# EAGLE design placaESP-AC_LAR_01 (EAGLE 8.0.0)
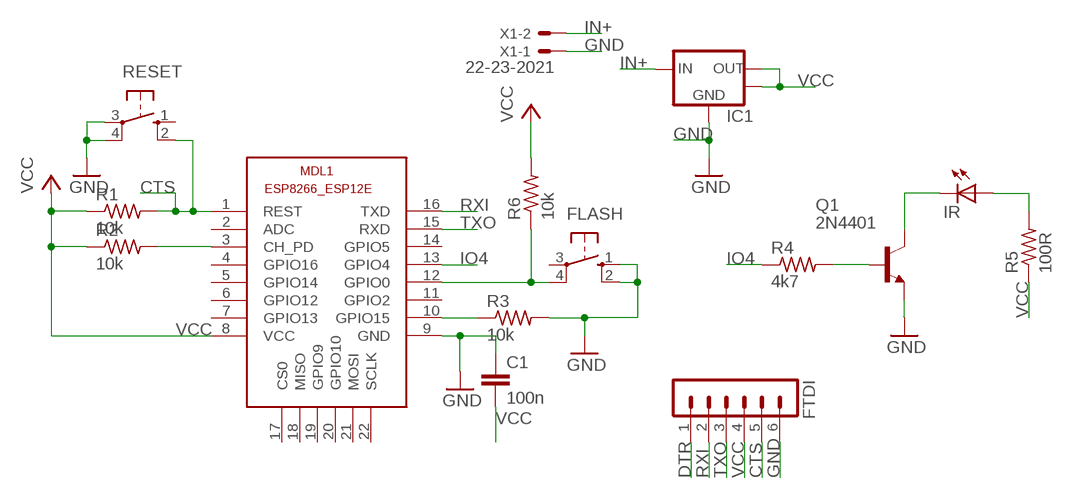
[diagram p0: schematic, sheet 1]

## Parts
C1  100n  C-EU025-025X050  [C025-025X050]
FLASH  10-XX  [B3F-10XX]
FTDI  MA06-1  [MA06-1]
IC1  AMS1117  [AMS1117]
IR  SFH482  [SFH482]
MDL1  ESP8266-12EESP8266-ESP12E  [ESP8266-ESP12E]
Q1  2N4401  2N4416  [TO92]
R1  10k  R-US_0207/10  [0207/10]
R2  10k  R-US_0207/10  [0207/10]
R3  10k  R-US_0207/10  [0207/10]
R4  4k7  R-US_0207/10  [0207/10]
R5  100R  R-US_0207/10  [0207/10]
R6  10k  R-US_0207/10  [0207/10]
RESET  10-XX  [B3F-10XX]
X1  22-23-2021  [22-23-2021]

## Nets
CTS: FTDI.5 MDL1.1(REST) R1.2 RESET.2(S1)
DTR: FTDI.1
GND: C1.1 FLASH.1(S) FLASH.2(S1) FTDI.6 IC1.GND(ADJ-GND) MDL1.9(GND) Q1.3(E) R3.2 RESET.3(P) RESET.4(P1) X1.1
IN+: IC1.VIN X1.2
IO4: MDL1.13(GPIO4) R4.1
N$1: MDL1.3(CH_PD) R2.2
N$2: IR.A R5.2
N$3: Q1.2(B) R4.2
N$4: IR.K(C) Q1.1(C)
N$5: MDL1.10(GPIO15) R3.1
N$6: FLASH.4(P1) MDL1.12(GPIO0) R6.1
RXI: FTDI.2 MDL1.16(TXD)
TXO: FTDI.3 MDL1.15(RXD)
VCC: C1.2 FTDI.4 IC1.HEATSINK IC1.VOUT MDL1.8(VCC) R1.1 R2.1 R5.1 R6.2
Unconnected: FLASH.3(P) MDL1.2(ADC) MDL1.4(GPIO16) MDL1.5(GPIO14) MDL1.6(GPIO12) MDL1.7(GPIO13) MDL1.11(GPIO2) MDL1.14(GPIO5) MDL1.17(CS0) MDL1.18(MISO) MDL1.19(GPIO9) MDL1.20(GPIO10) MDL1.21(MOSI) MDL1.22(SCLK) RESET.1(S)

## Library data of the parts
C1 = rcl:C-EU: CAPACITOR, European symbol
FLASH RESET = switch-omron:10-XX: OMRON SWITCH; MPN: B3F-1000; OC_FARNELL: 176432; OC_NEWARK: 36M3542
FTDI = con-lstb:MA06-1: PIN HEADER; OC_FARNELL: unknown; OC_NEWARK: unknown
IC1 = kaibader:AMS1117: Voltage Regulator AMS1117 Standard adjustable SMD voltage regulator.
IR = led:SFH482: IR LED infrared emitting diode, Infineon
MDL1 = ESP8266-ESP12E:ESP8266-12E: ESP8266-12E with additional I/O and GPIO04/05 corrected The author cannot warrant that this library is free from error or will meet your specific requirements. Created by PuceBaboon.com. Komagane, Nagano, JAPAN
Q1 = transistor-npn:2N4416: NPN Transistor
R1-R6 = rcl:R-US_: RESISTOR, American symbol
X1 = con-molex:22-23-2021: .100" (2.54mm) Center Header - 2 Pin; MF: MOLEX; MPN: 22-23-2021; OC_FARNELL: 1462926; OC_NEWARK: 25C3832

## Board
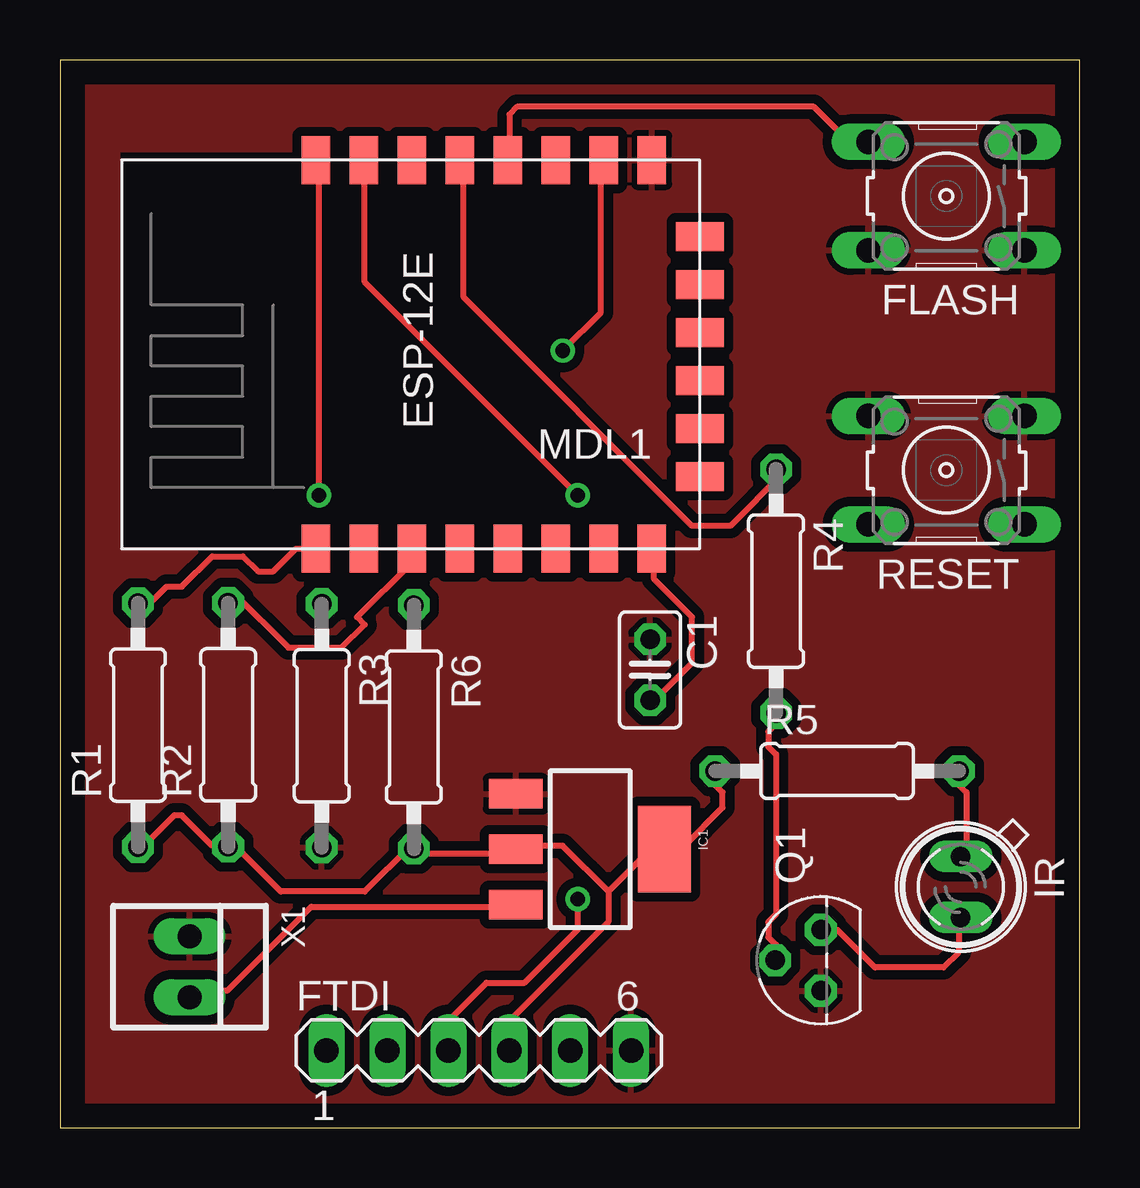
[diagram p1: board, top side]
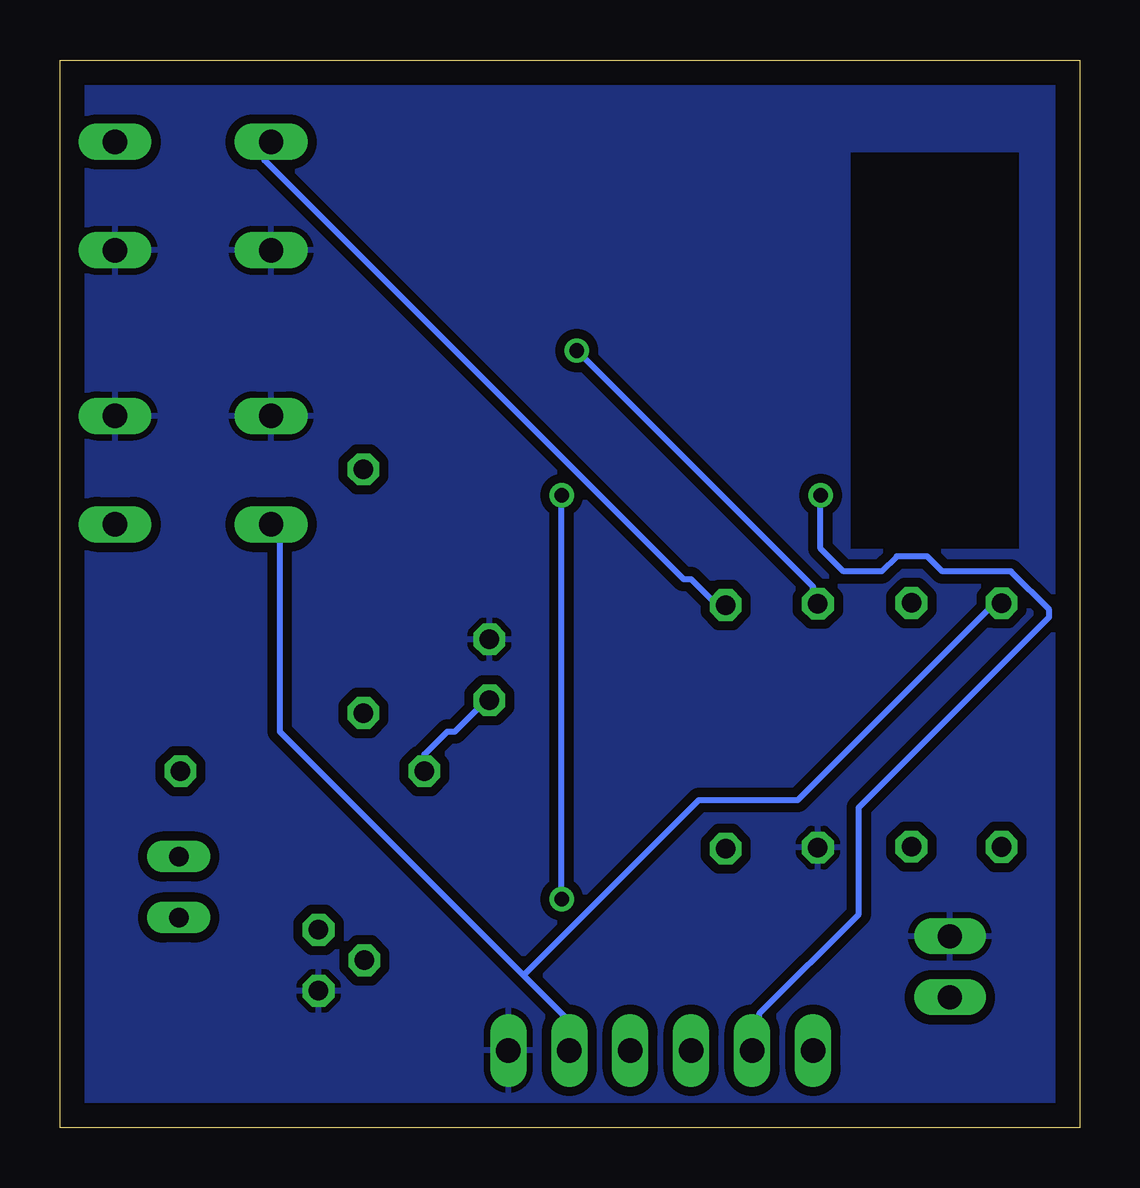
[diagram p2: board, bottom side, seen from below]

Size 42.5 x 44.5 mm. Coordinates in mm from the lower left corner, seen from the top.
Outline: 0,0 42.5,0 42.5,44.5 0,44.5 0,0
Copper layers (1*16): Top 0.035mm / dielectric 1.5mm / Bottom 0.035mm
Design rules "default *": minimum track width 10mil, minimum drill 24mil, track to track 15mil, track to pad 15mil, pad to pad 15mil, via to via 15mil, smd to smd 8mil, copper to edge 40mil, drill to drill 8mil, minimum pad ring 10mil, minimum via ring 8mil, stop-mask expansion 4mil, vias tented up to drill 0mil, thermal gap 10mil

### Footprints (pad centres in the part's own frame; a part is rotated, then mirrored left to right if it is on the bottom)
C025-025X050 = drill 0.813 octagon: 1 -1.27,0; 2 1.27,0
B3F-10XX = drill 1.016 long: 1 -3.251,2.261; 2 3.251,2.261; 3 -3.251,-2.261; 4 3.251,-2.261
MA06-1 = drill 1.016 long: 1 -6.35,0; 2 -3.81,0; 3 -1.27,0; 4 1.27,0; 5 3.81,0; 6 6.35,0
AMS1117 = smd 1.219 x 2.235: GND -2.311,-3.099; VIN 2.311,-3.099; VOUT 0,-3.099 | smd 3.6 x 2.2: HEATSINK 0,3.099
SFH482 = drill 0.813 long: A -1.27,0; K 1.27,0
ESP8266-ESP12E = smd 2 x 1.2: 1 -7.62,5.84; 2 -7.62,3.84; 3 -7.62,1.84; 4 -7.62,-0.16; 5 -7.62,-2.16; 6 -7.62,-4.16; 7 -7.62,-6.16; 8 -7.62,-8.16; 9 8.58,-8.16; 10 8.58,-6.16; 11 8.58,-4.16; 12 8.58,-2.16; 13 8.58,-0.16; 14 8.58,1.84; 15 8.58,3.84; 16 8.58,5.84 | smd 1.2 x 2: 17 -4.62,-10.16; 18 -2.62,-10.16; 19 -0.62,-10.16; 20 1.38,-10.16; 21 3.38,-10.16; 22 5.38,-10.16
TO92 = drill 0.813 octagon: 1 1.27,0; 2 0,1.905; 3 -1.27,0
0207/10 = drill 0.813 octagon: 1 -5.08,0; 2 5.08,0
22-23-2021 = drill 1 long: 1 -1.27,0; 2 1.27,0

### Placement (x,y rotation side)
C1  24.6,19.08 270 top
FLASH  36.95,38.83 180 top
FTDI  17.46,3.21 0 top
IC1  22.1,11.6 270 top
IR  37.55,10.03 270 top
MDL1  16.51,31.75 90 top
Q1  31.72,6.97 90 top
R1  3.25,16.78 90 top
R2  7.01,16.79 90 top
R3  10.91,16.75 270 top
R4  29.85,22.36 270 top
R5  32.39,14.86 0 top
R6  14.75,16.7 270 top
RESET  36.95,27.4 180 top
X1  5.4,6.7 270 top

### Tracks (layer width: path | path; a pad name or v marks a point on that pad's centre or on a via)
CTS
  Top 0.254: MDL1.1 9.84,24.13 8.89,23.18 8.26,23.18 7.62,23.81 6.35,23.81 5.08,22.54 4.45,22.54 3.49,21.59 R1.2
  Bottom 0.254: 23.18,6.35 33.34,16.51 33.34,24.77 33.66,25.08 RESET.2 | 23.18,6.35 21.27,4.45 21.27,3.49 FTDI.5 | 23.18,6.35 15.88,13.65 11.75,13.65 3.81,21.59 3.49,21.59 R1.2
GND
  pour Bottom: 0,0 0,44.5 42.5,44.5 42.5,0
  pour Top: 0,0 42.5,0 42.5,44.5 0,44.5
IN+
  Top 0.254: IC1.VIN 18.73,9.21 10.48,9.21 6.99,5.71 5.71,5.71 X1.2
IO4
  Top 0.254: MDL1.13 16.83,40.32 16.83,34.61 26.35,25.08 27.94,25.08 30.16,27.3 R4.1
N$1
  Top 0.254: MDL1.3 14.61,24.13 14.61,23.5 12.38,21.27 12.7,20.95 11.75,20 9.53,20 7.3,22.23 6.99,21.91 R2.2
N$2
  Top 0.254: IR.A 37.78,11.43 37.78,13.97 37.15,14.61 37.47,14.92 R5.2
N$3
  Top 0.254: Q1.2 29.84,6.99 29.84,7.62 29.53,7.94 29.53,8.57 29.84,8.89 29.84,15.56 29.53,15.88 29.53,16.51 30.16,17.14 R4.2
N$4
  Top 0.254: Q1.1 31.75,8.26 32.38,8.26 33.97,6.67 36.83,6.67 37.47,7.3 37.47,8.57 IR.K
N$5  (via drill 0.61)
  Top 0.254: v20.95,32.38 22.54,33.97 22.54,40.32 MDL1.10
  Bottom 0.254: v20.95,32.38 11.11,22.54 11.11,21.91 R3.1
N$6
  Top 0.254: MDL1.12 18.73,40.64 18.73,42.23 19.05,42.55 31.43,42.55 32.7,41.27 33.66,41.27 FLASH.4
  Bottom 0.254: R6.1 14.92,21.91 15.24,21.91 16.19,22.86 16.51,22.86 33.97,40.32 33.97,40.96 FLASH.4
RXI  (via drill 0.61)
  Top 0.254: v10.79,26.35 10.79,40.32 MDL1.16
  Bottom 0.254: v10.79,26.35 10.79,24.13 9.84,23.18 8.26,23.18 7.62,23.81 6.35,23.81 5.71,23.18 2.86,23.18 1.27,21.59 1.27,21.27 9.21,13.34 9.21,8.89 13.34,4.76 13.34,3.49 FTDI.2
TXO  (via drill 0.61)
  Top 0.254: v21.59,26.35 12.7,35.24 12.7,40.32 MDL1.15 | v21.59,9.53 21.59,8.26 19.37,6.03 17.78,6.03 16.19,4.45 16.19,3.49 FTDI.3
  Bottom 0.254: v21.59,9.53 v21.59,26.35
VCC
  Top 0.254: R1.1 3.49,11.75 4.76,13.02 5.08,13.02 6.35,11.75 6.99,11.75 R2.1 7.3,11.43 7.62,11.43 9.21,9.84 12.7,9.84 14.61,11.75 R6.2 14.92,11.43 18.73,11.43 IC1.VOUT 19.05,11.75 20.95,11.75 22.86,9.84 | MDL1.8 24.77,24.13 24.77,22.86 26.35,21.27 26.35,19.37 25.08,18.1 25.08,17.78 24.77,17.78 C1.2 | R5.1 27.3,14.61 27.3,14.29 27.62,13.97 27.62,13.34 26.04,11.75 25.4,11.75 IC1.HEATSINK 25.08,11.43 24.45,11.43 22.86,9.84 | 22.86,9.84 22.86,8.57 18.73,4.45 18.73,3.49 FTDI.4
  Bottom 0.254: C1.2 24.77,17.78 26.04,16.51 26.35,16.51 27.3,15.56 27.3,14.92 R5.1